# Altium schematic sheet Revisions.SchDoc: Printhead PCB
size A4; Revision: 2012-K
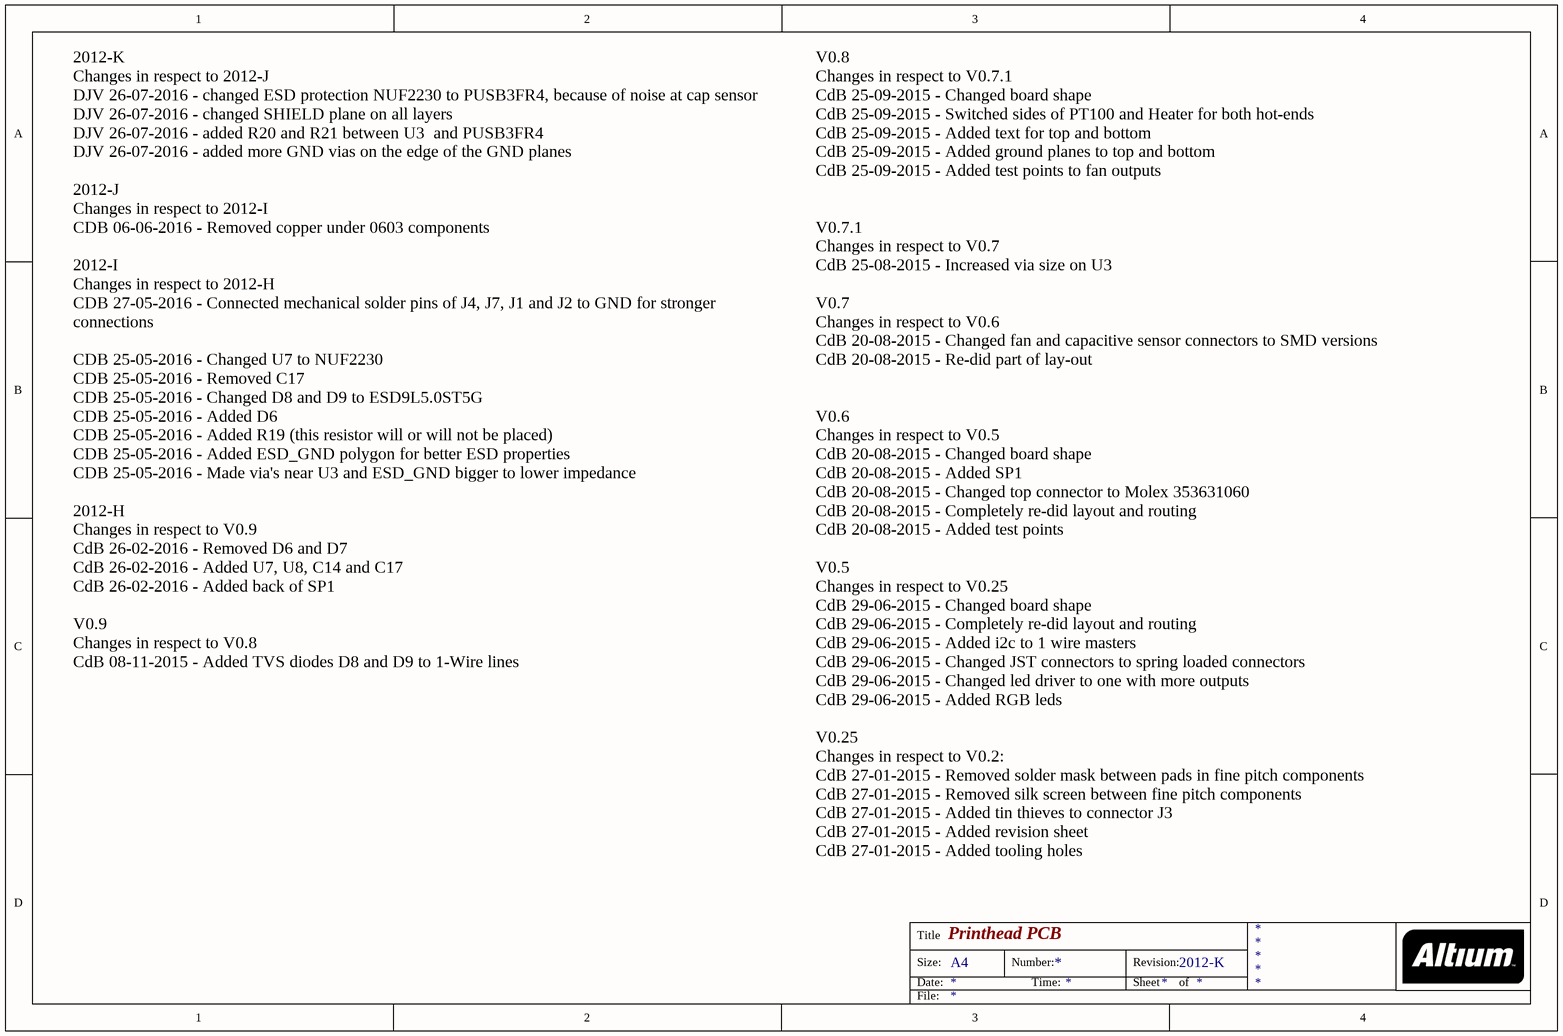
[diagram p0: Revisions.SchDoc]

## Notes on the sheet
- 2012-K
  Changes in respect to 2012-J
  DJV 26-07-2016 - changed ESD protection NUF2230 to PUSB3FR4, because of noise at cap sensor
  DJV 26-07-2016 - changed SHIELD plane on all layers
  DJV 26-07-2016 - added R20 and R21 between U3  and PUSB3FR4
  DJV 26-07-2016 - added more GND vias on the edge of the GND planes
  2012-J
  Changes in respect to 2012-I
  CDB 06-06-2016 - Removed copper under 0603 components
  2012-I
  Changes in respect to 2012-H
  CDB 27-05-2016 - Connected mechanical solder pins of J4, J7, J1 and J2 to GND for stronger connections
  CDB 25-05-2016 - Changed U7 to NUF2230
  CDB 25-05-2016 - Removed C17
  CDB 25-05-2016 - Changed D8 and D9 to ESD9L5.0ST5G
  CDB 25-05-2016 - Added D6
  CDB 25-05-2016 - Added R19 (this resistor will or will not be placed)
  CDB 25-05-2016 - Added ESD_GND polygon for better ESD properties
  CDB 25-05-2016 - Made via's near U3 and ESD_GND bigger to lower impedance
  2012-H
  Changes in respect to V0.9
  CdB 26-02-2016 - Removed D6 and D7
  CdB 26-02-2016 - Added U7, U8, C14 and C17
  CdB 26-02-2016 - Added back of SP1
  V0.9
  Changes in respect to V0.8
  CdB 08-11-2015 - Added TVS diodes D8 and D9 to 1-Wire lines
- V0.8
  Changes in respect to V0.7.1
  CdB 25-09-2015 - Changed board shape
  CdB 25-09-2015 - Switched sides of PT100 and Heater for both hot-ends
  CdB 25-09-2015 - Added text for top and bottom
  CdB 25-09-2015 - Added ground planes to top and bottom
  CdB 25-09-2015 - Added test points to fan outputs
  V0.7.1
  Changes in respect to V0.7
  CdB 25-08-2015 - Increased via size on U3
  V0.7
  Changes in respect to V0.6
  CdB 20-08-2015 - Changed fan and capacitive sensor connectors to SMD versions
  CdB 20-08-2015 - Re-did part of lay-out
  V0.6
  Changes in respect to V0.5
  CdB 20-08-2015 - Changed board shape
  CdB 20-08-2015 - Added SP1
  CdB 20-08-2015 - Changed top connector to Molex 353631060
  CdB 20-08-2015 - Completely re-did layout and routing
  CdB 20-08-2015 - Added test points
  V0.5
  Changes in respect to V0.25
  CdB 29-06-2015 - Changed board shape
  CdB 29-06-2015 - Completely re-did layout and routing
  CdB 29-06-2015 - Added i2c to 1 wire masters
  CdB 29-06-2015 - Changed JST connectors to spring loaded connectors
  CdB 29-06-2015 - Changed led driver to one with more outputs
  CdB 29-06-2015 - Added RGB leds
  V0.25
  Changes in respect to V0.2:
  CdB 27-01-2015 - Removed solder mask between pads in fine pitch components
  CdB 27-01-2015 - Removed silk screen between fine pitch components
  CdB 27-01-2015 - Added tin thieves to connector J3
  CdB 27-01-2015 - Added revision sheet
  CdB 27-01-2015 - Added tooling holes
- Title
- Size:
- Date:
- A4
- Number:
- Time:
- Revision:
- Sheet
- of
- File: